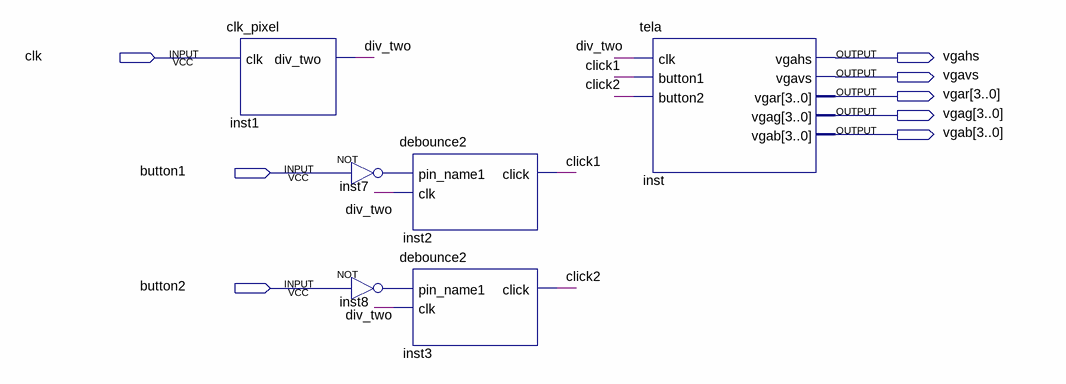
[diagram p0: schematic sheet]
// Quartus schematic vgasync.bdf as structural Verilog: 6 symbols, 8 pins
module vgasync (
  input  clk,
  input  button1,
  input  button2,
  output vgahs,
  output vgavs,
  output [3:0] vgar,
  output [3:0] vgag,
  output [3:0] vgab
);

  wire click1, click2, div_two, inst7_out, inst8_out;

  clk_pixel inst1 (.clk(clk), .div_two(div_two));
  not inst7 (inst7_out, button1);
  not inst8 (inst8_out, button2);
  debounce2 inst2 (.pin_name1(inst7_out), .clk(div_two), .click(click1));
  debounce2 inst3 (.pin_name1(inst8_out), .clk(div_two), .click(click2));
  tela inst (
    .clk(div_two), .button1(click1), .button2(click2), .vgahs(vgahs), .vgavs(vgavs), .vgar(vgar),
    .vgag(vgag), .vgab(vgab));
endmodule
